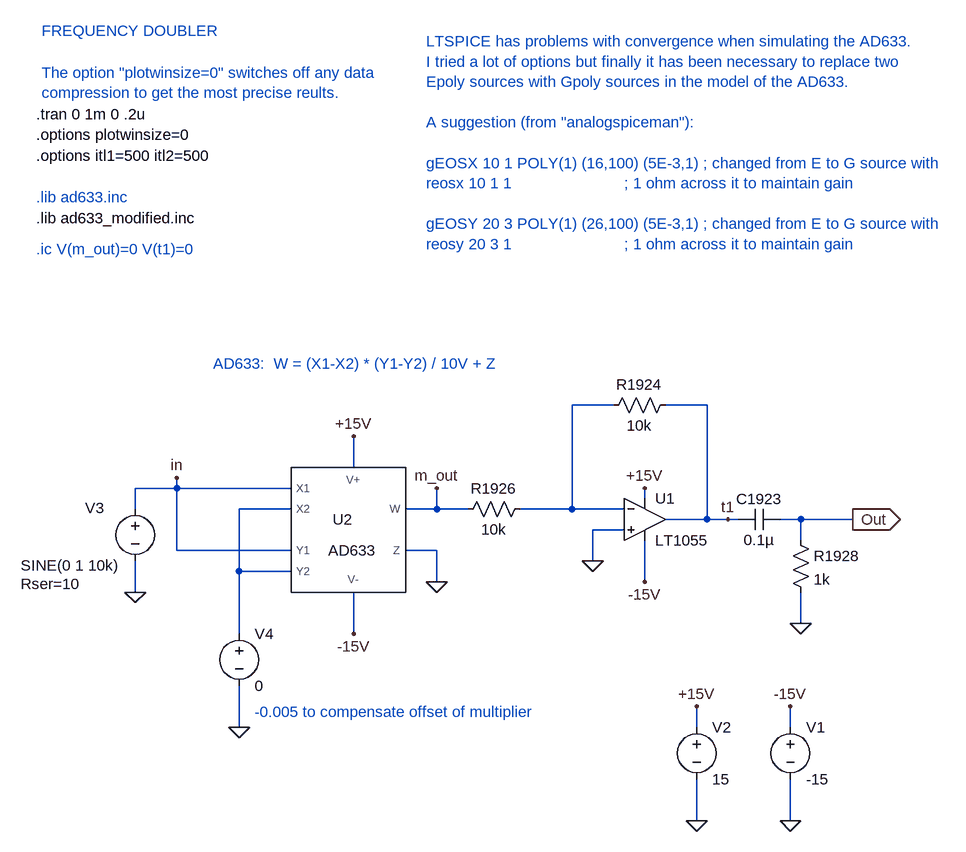
[diagram p0: schematic ad633_multiplier.asc]
ad633_multiplier.asc, the LTspice schematic file:
Version 4
SHEET 1 1300 1096
WIRE -288 320 -352 320
WIRE -144 320 -208 320
WIRE -688 416 -688 368
WIRE -960 448 -960 432
WIRE -960 448 -1024 448
WIRE -784 448 -960 448
WIRE -240 464 -240 448
WIRE -1024 480 -1024 448
WIRE -784 480 -864 480
WIRE -560 480 -560 448
WIRE -560 480 -608 480
WIRE -512 480 -560 480
WIRE -352 480 -352 320
WIRE -352 480 -432 480
WIRE -272 480 -352 480
WIRE -144 496 -144 320
WIRE -144 496 -208 496
WIRE -112 496 -144 496
WIRE -96 496 -112 496
WIRE 0 496 -32 496
WIRE 80 496 0 496
WIRE -272 512 -320 512
WIRE 0 528 0 496
WIRE -960 544 -960 448
WIRE -784 544 -960 544
WIRE -560 544 -608 544
WIRE -320 560 -320 512
WIRE -864 576 -864 480
WIRE -784 576 -864 576
WIRE -560 592 -560 544
WIRE -240 592 -240 528
WIRE -1024 608 -1024 560
WIRE 0 656 0 608
WIRE -864 672 -864 576
WIRE -688 672 -688 608
WIRE -864 816 -864 752
WIRE -160 816 -160 784
WIRE -16 816 -16 784
WIRE -160 960 -160 896
WIRE -16 960 -16 896
FLAG -320 560 0
FLAG 0 656 0
FLAG -240 448 +15V
FLAG -688 368 +15V
FLAG -240 592 -15V
FLAG -688 672 -15V
FLAG -16 784 -15V
FLAG -160 784 +15V
FLAG -160 960 0
FLAG -16 960 0
FLAG -864 816 0
FLAG -560 592 0
FLAG 80 496 Out
IOPIN 80 496 Out
FLAG -1024 608 0
FLAG -960 432 in
FLAG -560 448 m_out
FLAG -112 496 t1
SYMBOL res -528 496 R270
WINDOW 0 32 56 VTop 0
WINDOW 3 0 56 VBottom 0
SYMATTR InstName R1926
SYMATTR Value 10k
SYMBOL res -304 336 R270
WINDOW 0 32 56 VTop 0
WINDOW 3 0 56 VBottom 0
SYMATTR InstName R1924
SYMATTR Value 10k
SYMBOL res -16 512 R0
SYMATTR InstName R1928
SYMATTR Value 1k
SYMBOL voltage -16 800 R0
WINDOW 123 0 0 Left 0
WINDOW 39 0 0 Left 0
SYMATTR InstName V1
SYMATTR Value -15
SYMBOL voltage -160 800 R0
WINDOW 123 0 0 Left 0
WINDOW 39 0 0 Left 0
SYMATTR InstName V2
SYMATTR Value 15
SYMBOL ad633 -688 512 R0
SYMATTR InstName U2
SYMBOL voltage -1024 464 R0
WINDOW 0 -77 14 Left 0
WINDOW 3 -176 103 Left 0
WINDOW 123 -176 131 Left 0
WINDOW 39 -176 131 Left 0
SYMATTR InstName V3
SYMATTR Value SINE(0 1 10k)
SYMATTR SpiceLine Rser=10
SYMBOL cap -96 512 R270
WINDOW 0 32 32 VTop 0
WINDOW 3 0 32 VBottom 0
SYMATTR InstName C1923
SYMATTR Value 0.1µ
SYMBOL voltage -864 656 R0
SYMATTR InstName V4
SYMATTR Value 0
SYMBOL Opamps\\LT1055 -240 432 R0
SYMATTR InstName U1
TEXT -1168 -192 Left 0 ;The option "plotwinsize=0" switches off any data \ncompression to get the most precise reults.
TEXT -1176 -96 Left 0 !.options plotwinsize=0
TEXT -576 -240 Left 0 ;LTSPICE has problems with convergence when simulating the AD633.\nI tried a lot of options but finally it has been necessary to replace two\nEpoly sources with Gpoly sources in the model of the AD633.\n \nA suggestion (from "analogspiceman"):\n \ngEOSX 10 1 POLY(1) (16,100) (5E-3,1) ; changed from E to G source with\nreosx 10 1 1                         ; 1 ohm across it to maintain gain\n \ngEOSY 20 3 POLY(1) (26,100) (5E-3,1) ; changed from E to G source with\nreosy 20 3 1                         ; 1 ohm across it to maintain gain
TEXT -1176 32 Left 0 !.lib ad633_modified.inc
TEXT -904 256 Left 0 ;AD633:  W = (X1-X2) * (Y1-Y2) / 10V + Z
TEXT -1176 -128 Left 0 !.tran 0 1m 0 .2u
TEXT -1176 80 Left 0 ;.ic V(m_out)=0 V(t1)=0
TEXT -1176 -64 Left 0 !.options itl1=500 itl2=500
TEXT -840 792 Left 0 ;-0.005 to compensate offset of multiplier
TEXT -1176 0 Left 0 ;.lib ad633.inc
TEXT -1168 -256 Left 0 ;FREQUENCY DOUBLER

The netlist it stands for:
* ad633_multiplier.asc
R1926 m_out N001 10k
R1924 N001 t1 10k
R1928 Out 0 1k
V1 -15V 0 -15
V2 +15V 0 15
XU2 in N002 in N002 -15V 0 m_out +15V AD633  ; pins X1 X2 Y1 Y2 V- Z W V+
V3 in 0 SINE(0 1 10k) Rser=10
C1923 t1 Out 0.1µ
V4 N002 0 0
XU1 0 N001 +15V -15V t1 LT1055  ; pins In+ In- V+ V- OUT
* The option "plotwinsize=0" switches off any data
* compression to get the most precise reults.
.options plotwinsize=0
* LTSPICE has problems with convergence when simulating the AD633.
* I tried a lot of options but finally it has been necessary to replace two
* Epoly sources with Gpoly sources in the model of the AD633.
* A suggestion (from "analogspiceman"):
* gEOSX 10 1 POLY(1) (16,100) (5E-3,1) ; changed from E to G source with
* reosx 10 1 1                         ; 1 ohm across it to maintain gain
* gEOSY 20 3 POLY(1) (26,100) (5E-3,1) ; changed from E to G source with
* reosy 20 3 1                         ; 1 ohm across it to maintain gain
.lib ad633_modified.inc
* AD633:  W = (X1-X2) * (Y1-Y2) / 10V + Z
.tran 0 1m 0 .2u
* .ic V(m_out)=0 V(t1)=0
.options itl1=500 itl2=500
* -0.005 to compensate offset of multiplier
* .lib ad633.inc
* FREQUENCY DOUBLER
.backanno
.end